# EasyEDA Pro project ProPrj_MiniFoc_AT32F435.epro, board 核心板
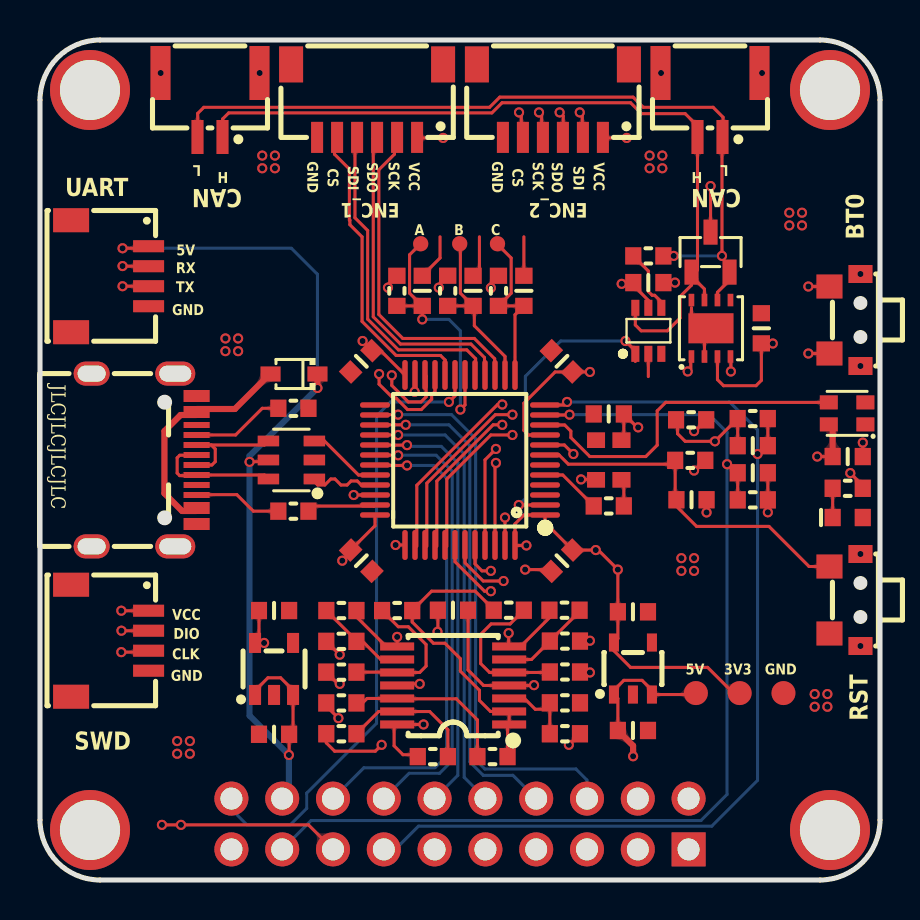
[diagram p5: board, top side]
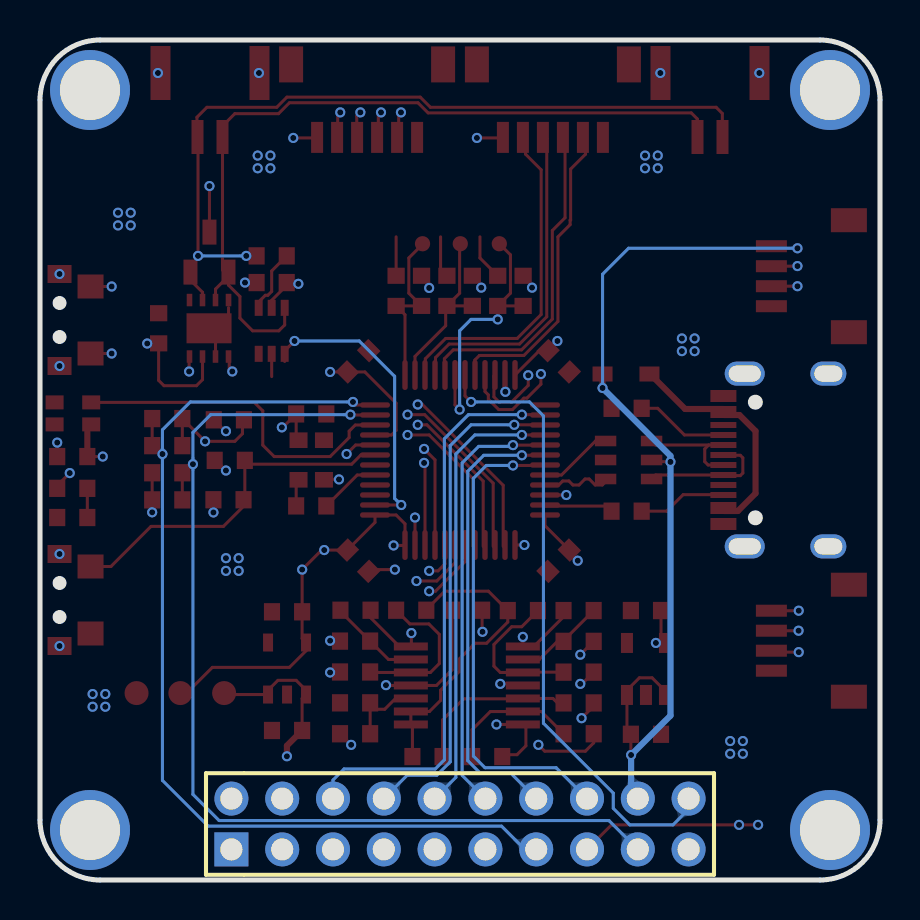
[diagram p6: board, bottom side, seen from below]

Outline 42 x 42 mm; copper layers: Top Layer, Inner1, Inner2, Bottom Layer. Coordinates in mm from the lower left corner of the outline.
Outline path: 0,39 0,3 arc(0.88,0.88) 3,0 39,0 arc(41.12,0.88) 42,3 42,39 arc(41.12,41.12) 39,42 3,42 arc(0.88,41.12) 0,39
Stack: Top Layer 0.035mm / Dielectric1 0.48mm PP er 4.5 / Inner1 0.035mm / Dielectric2 0.48mm FR4 er 4.5 / Inner2 0.035mm / Dielectric3 0.48mm PP er 4.5 / Bottom Layer 0.035mm

## Design rules (mm)
net USB_DP: USB
net USB_DM: USB
template: 用户自定义配置
spacing Default (default): track to track 0.127, other pairs 0 to 0.127
track width Default (default): min 0.152, default 0.152, max 25.4
differential pair differentialPair (default): width min 0.127, default 0.254, max 2.54; gap min 0.152, default 0.152
via Default (default): diameter min 0.508, default 0.508, max 100.025; hole min 0.305, default 0.305, max 59.995
net VCC uses 直连
net GND uses 直连
net 5V uses 直连

## Placement (name value [footprint] x y rotation side)
C1  100nF  [C0603_SMALL]  16.07 25.93 45 top
C7  2.2uF  [C0603_SMALL]  35.64 20.36 180 top
C10  100nF  [C0603_SMALL]  40.39 21.17 0 top
C13  100nF  [C0603_SMALL]  32.58 19.01 180 top
C14  100nF  [C0603_SMALL]  26.1 15.97 45 top
C17  100nF  [C0603_SMALL]  16.07 15.97 135 top
C18  100nF  [C0603_SMALL]  36.07 27.59 270 top
C19  100nF  [C0603_SMALL]  28.44 23.3 0 top
C30  1uF  [C0603_SMALL]  11.7 13.47 180 top
C31  1uF  [C0603_SMALL]  11.7 7.29 0 top
C32  100nF  [C0603_SMALL]  26.1 25.93 135 top
C46  2.2uF  [C0603_SMALL]  35.64 21.72 0 top
C89  10uF  [C0603_SMALL]  29.65 7.48 180 top
C90  10uF  [C0603_SMALL]  29.65 13.41 180 top
C91  1nF  [C0603_SMALL]  24.19 29.46 270 top
C92  1nF  [C0603_SMALL]  21.65 29.46 270 top
C93  1nF  [C0603_SMALL]  19.11 29.46 270 top
C94  100nF  [C0603_SMALL]  20.65 13.49 0 top
C95  100nF  [C0603_SMALL]  30.42 29.87 0 top
CN1  M1010RS-04P  [CONN-SMD_M1010RS-04P]  3.49 30.19 270 top
CN4  M1010RS-04P  [CONN-SMD_M1010RS-04P]  3.49 11.96 270 top
CN5  M1010RS-06P  [CONN-SMD_M1010RS-06P]  16.35 38.96 0 top
CN7  X1251WRS-02HF-LPSW  [CONN-SMD_2P-P1.25_X1251WRS-02HF-LPSW]  33.5 38.75 180 top
CN8  X1251WRS-02HF-LPSW  [CONN-SMD_2P-P1.25_X1251WRS-02HF-LPSW]  8.5 38.75 180 top
CN9  M1010RS-06P  [CONN-SMD_M1010RS-06P]  25.65 38.96 0 top
D1  -  [SOT-23-6_L2.9-W1.6-P0.95-LS2.8-BL]  12.57 21 90 top
D8  1N5819WS  [SOD-323_L1.8-W1.3-LS2.5-RD]  12.7 25.3 180 top
D9  NUP2105LT1G  [SOT-23-3_L2.9-W1.3-P1.90-LS2.4-BR]  33.53 31.4 270 top
H2  2.54-2*10  [HDR-TH_20P-P2.54-V-M-R2-C10-S2.54]  21 2.8 180 bottom
LED2  NCD0603B1  [LED0603_RED_SMALL]  40.39 18.12 0 top
LED4  WS2812B-2020  [LED-SMD_4P-L2.0-W2.0-TL_WS2812B-2020]  40.35 23.33 180 top
NOREF  -  [Pad_e1832]  2.5 2.5 180 top
NOREF#2  -  [Pad_e1834]  39.5 39.5 180 top
NOREF#3  -  [Pad_e1566]  39.5 2.5 180 top
NOREF#4  -  [Pad_e1565]  2.5 39.5 180 top
R4  10kΩ  [R0603_SMALL]  32.51 20.98 180 top
R6  1kΩ  [R0603_SMALL]  40.39 19.58 180 top
R9  120Ω  [R0603_SMALL]  30.42 31.2 180 top
R10  10kΩ  [R0603_SMALL]  32.56 23.01 180 top
R12  22Ω  [R0603_SMALL]  28.44 18.7 0 top
R13  3.3kΩ  [R0603_SMALL]  35.64 23.07 180 top
R15  3.3kΩ  [R0603_SMALL]  35.64 19.01 0 top
R20  1kΩ  [R0603_SMALL]  26.25 8.86 0 top
R21  1kΩ  [R0603_SMALL]  26.25 7.31 180 top
R67  100kΩ  [R0603_SMALL]  19.64 6.17 180 top
R71  100kΩ  [R0603_SMALL]  15.07 13.47 0 top
R75  100kΩ  [R0603_SMALL]  26.23 13.49 180 top
R76  100kΩ  [R0603_SMALL]  23.44 13.49 0 top
R77  100kΩ  [R0603_SMALL]  17.86 13.47 180 top
R78  100kΩ  [R0603_SMALL]  22.63 6.17 180 top
R79  2kΩ  [R0603_SMALL]  15.07 7.31 180 top
R80  2kΩ  [R0603_SMALL]  15.07 8.85 180 top
R81  2kΩ  [R0603_SMALL]  15.07 11.93 180 top
R82  2kΩ  [R0603_SMALL]  15.07 10.39 180 top
R83  2kΩ  [R0603_SMALL]  26.25 11.94 0 top
R84  2kΩ  [R0603_SMALL]  26.25 10.4 0 top
R85  22Ω  [R0603_SMALL]  22.92 29.46 90 top
R86  22Ω  [R0603_SMALL]  20.38 29.46 90 top
R87  22Ω  [R0603_SMALL]  17.84 29.46 90 top
R88  5.1kΩ  [R0603_SMALL]  12.67 18.44 0 top
R89  5.1kΩ  [R0603_SMALL]  12.67 23.58 0 top
SW3  TS24CA  [SW-SMD_TS24CA]  40.25 28 270 top
SW4  TS24CA  [SW-SMD_TS24CA]  40.25 14 270 top
TP1  Testpoint 1.6mm  [TESTPOINT 1.6MM]  34.98 9.35 0 top
TP2  Testpoint 1.6mm  [TESTPOINT 1.6MM]  32.79 9.35 0 top
TP3  Testpoint 1.6mm  [testpoint 1.6mm]  22.87 31.81 0 top
TP4  Testpoint 1.6mm  [testpoint 1.6mm]  19.03 31.81 0 top
TP6  Testpoint 1.6mm  [testpoint 1.6mm]  20.99 31.81 0 top
TP7  Testpoint 1.6mm  [TESTPOINT 1.6MM]  37.17 9.35 0 top
U3  AT32F435CGT7  [LQFP-48_L7.0-W7.0-P0.50-LS9.0-BL]  21 21 90 top
U6  SIT3051TK  [DFN-8_L3.0-W3.0-P0.65-BL-EP]  33.55 27.59 0 top
U7  XC6210B332MR  [SOT-25_L3.0-W1.6-P0.95-LS2.8-BL]  29.65 10.57 0 top
U13  LP5907MFX-3.3/NOPB  [SOT-23-5_L3.0-W1.7-P0.95-LS2.8-BR]  11.7 10.55 270 top
U16  RS724XQ  [TSSOP-14_L5.0-W4.4-P0.65-LS6.4-BL]  20.66 9.73 90 top
U17  GS4157B-CR  [SC70-6_L2.1-W1.3-P0.65-LS2.3-BL]  30.42 27.46 0 top
USBC1  TYPE-C-31-M-12  [USB-C_SMD-TYPE-C-31-M-12]  5.21 21 270 top
X1  8MHz  [OSC-SMD_4P-L2.5-W2.0-BL_DSB321SDA]  28.44 21 270 top

## Footprints (pads in the part's own frame, mm; a bottom-side part is the same pattern mirrored in y, then rotated)
C0603_SMALL
  rect 0.806x0.864 smd: 1(-0.753,0) 2(0.753,0)
CONN-SMD_2P-P1.25_X1251WRS-02HF-LPSW
  rect 0.6x1.7 smd: 1(-0.625,1.6) 2(0.625,1.6)
  rect 1x2.7 smd: 3(2.475,-1.6) 4(-2.475,-1.6)
CONN-SMD_M1010RS-04P
  rect 0.6x1.55 smd: 1(-1.5,1.938) 2(-0.5,1.938) 3(0.5,1.938) 4(1.5,1.938)
  rect 1.2x1.8 smd: 5(2.8,-1.938) 6(-2.8,-1.938)
CONN-SMD_M1010RS-06P
  rect 1.2x1.8 smd: 0(-3.8,1.825) 0(3.8,1.825)
  rect 0.6x1.55 smd: 1(2.5,-1.825) 2(1.5,-1.825) 3(0.5,-1.825) 4(-0.5,-1.825) 5(-1.5,-1.825) 6(-2.5,-1.825)
DFN-8_L3.0-W3.0-P0.65-BL-EP
  rect 0.28x0.625 smd: 1(-0.976,-1.412) 2(-0.325,-1.412) 3(0.325,-1.412) 4(0.976,-1.412) 5(0.976,1.412) 6(0.325,1.412) 7(-0.325,1.412) 8(-0.976,1.412)
  rect 2.251x1.501 smd: 9(0,0)
HDR-TH_20P-P2.54-V-M-R2-C10-S2.54
  rect 1.7x1.7 hole 1.1: 1(-11.43,-1.27)
  round 1.7 hole 1.1: 2(-11.43,1.27) 3(-8.89,-1.27) 4(-8.89,1.27) 5(-6.35,-1.27) 6(-6.35,1.27) 7(-3.81,-1.27) 8(-3.81,1.27) 9(-1.27,-1.27) 10(-1.27,1.27) 11(1.27,-1.27) 12(1.27,1.27) 13(3.81,-1.27) 14(3.81,1.27) 15(6.35,-1.27) 16(6.35,1.27) 17(8.89,-1.27) 18(8.89,1.27) 19(11.43,-1.27) 20(11.43,1.27)
LED0603_RED_SMALL
  rect 0.806x0.864 smd: 1(0.753,0) 2(-0.753,0)
LED-SMD_4P-L2.0-W2.0-TL_WS2812B-2020
  rect 0.9x0.7 smd: 1(-0.915,0.55) 2(-0.915,-0.55) 3(0.915,-0.55) 4(0.915,0.55)
LQFP-48_L7.0-W7.0-P0.50-LS9.0-BL
  oval 0.27x1.5 smd: 1(-2.75,-4.25) 2(-2.25,-4.25) 3(-1.75,-4.25) 4(-1.25,-4.25) 5(-0.75,-4.25) 6(-0.25,-4.25) 7(0.25,-4.25) 8(0.75,-4.25) 9(1.25,-4.25) 10(1.75,-4.25) 11(2.25,-4.25) 12(2.75,-4.25) 25(2.75,4.25) 26(2.25,4.25) 27(1.75,4.25) 28(1.25,4.25) 29(0.75,4.25) 30(0.25,4.25) 31(-0.25,4.25) 32(-0.75,4.25) 33(-1.25,4.25) 34(-1.75,4.25) 35(-2.25,4.25) 36(-2.75,4.25)
  oval 1.5x0.27 smd: 13(4.25,-2.75) 14(4.25,-2.25) 15(4.25,-1.75) 16(4.25,-1.25) 17(4.25,-0.75) 18(4.25,-0.25) 19(4.25,0.25) 20(4.25,0.75) 21(4.25,1.25) 22(4.25,1.75) 23(4.25,2.25) 24(4.25,2.75) 37(-4.25,2.75) 38(-4.25,2.25) 39(-4.25,1.75) 40(-4.25,1.25) 41(-4.25,0.75) 42(-4.25,0.25) 43(-4.25,-0.25) 44(-4.25,-0.75) 45(-4.25,-1.25) 46(-4.25,-1.75) 47(-4.25,-2.25) 48(-4.25,-2.75)
OSC-SMD_4P-L2.5-W2.0-BL_DSB321SDA
  rect 0.78x0.9 smd: 1(-0.99,-0.635) 2(0.99,-0.635) 3(0.99,0.635) 4(-0.99,0.635)
Pad_e1565
  round 4 hole 3: 1(0,0)
Pad_e1566
  round 4 hole 3.005x3: 1(0,0)
Pad_e1832
  round 4 hole 3.005x3: 1(0,0)
Pad_e1834
  round 4 hole 3.005x3: 1(0,0)
R0603_SMALL
  rect 0.806x0.864 smd: 1(-0.753,0) 2(0.753,0)
SC70-6_L2.1-W1.3-P0.65-LS2.3-BL
  rect 0.4x0.8 smd: 1(-0.65,-1.15) 2(-0.001,-1.15) 3(0.65,-1.15) 4(0.65,1.15) 5(0,1.15) 6(-0.65,1.15)
SOD-323_L1.8-W1.3-LS2.5-RD
  rect 1x0.75 smd: 1(-1.173,0) 2(1.173,0)
SOT-23-3_L2.9-W1.3-P1.90-LS2.4-BR
  rect 1.25x0.7 smd: 1(1,-0.95) 2(1,0.95) 3(-1,0)
SOT-23-5_L3.0-W1.7-P0.95-LS2.8-BR
  rect 1x0.6 smd: 1(1.3,-0.95) 2(1.3,0) 3(1.3,0.95) 4(-1.3,0.95) 5(-1.3,-0.95)
SOT-23-6_L2.9-W1.6-P0.95-LS2.8-BL
  rect 0.532x1.072 smd: 1(-0.95,-1.149) 2(0,-1.149) 3(0.95,-1.149) 4(0.95,1.149) 5(0,1.149) 6(-0.95,1.149)
SOT-25_L3.0-W1.6-P0.95-LS2.8-BL
  rect 0.5x0.899 smd: 1(-0.95,-1.3) 2(0,-1.3) 3(0.95,-1.3) 4(0.95,1.3) 5(-0.95,1.3)
SW-SMD_TS24CA
  rect 0.9x1.2 smd: 1(-2.3,0.775) 2(2.3,0.775)
  rect 1.2x1.3 smd: 3(-1.675,-0.775) 4(1.675,-0.775)
testpoint 1.6mm
  round 0.762 smd: 1(0,0)
TESTPOINT 1.6MM
  round 1.2 smd: 1(0,0)
TSSOP-14_L5.0-W4.4-P0.65-LS6.4-BL
  rect 0.4x1.7 smd: 1(-1.95,-2.8) 2(-1.3,-2.8) 3(-0.65,-2.8) 4(0,-2.8) 5(0.65,-2.8) 6(1.3,-2.8) 7(1.95,-2.8) 8(1.95,2.8) 9(1.3,2.8) 10(0.65,2.8) 11(0,2.8) 12(-0.65,2.8) 13(-1.3,2.8) 14(-1.95,2.8)
USB-C_SMD-TYPE-C-31-M-12
  oval 1.2x1.8 hole 0.8x1.4: 0(-4.32,-2.624) 1(4.32,-2.624)
  oval 1.2x2 hole 0.8x1.6: 2(4.32,1.556) 3(-4.32,1.556)
  rect 0.3x1.3 smd: A1(-3.35,2.623) A4(-2.55,2.623) A5(-1.25,2.623) A6(-0.25,2.623) A7(0.25,2.623) A8(1.25,2.624) A9(2.55,2.623) A12(3.35,2.623) B1(3.05,2.623) B4(2.25,2.623) B5(1.75,2.623) B6(0.75,2.623) B7(-0.75,2.623) B8(-1.75,2.624) B9(-2.25,2.623) B12(-3.05,2.623)

## Nets
As in the schematic.

Pads without a net: CN5 0; CN9 0; LED4 1; NOREF 1; NOREF#2 1; NOREF#3 1; NOREF#4 1; U3 3 4 6 25; U6 5; U7 4; U13 4; U17 3; USBC1 1 2 3 A8 B8; X1 1

## Via types
v1: diameter 0.508, hole 0.305, Top Layer to Bottom Layer, 129 vias

## Routing (per net, layer and track width the routed paths; a pad name or vN(x,y) marks a point on that pad's centre or on a via; arc(x,y) is an arc through that point)
5V: length 97.6
  Top Layer w0.152: 10.48,20.92 11.34,20.92 D1.5 ; TP2.1 32.72,9.27 U7.3 30.6,9.49 30.1,9.98 29.19,9.98 28.7,9.49 U7.1 28.89,9.08 C89.2 ; C10.1 v1(38.86,21.17) ; v1(4.13,31.59) 5.39,31.59 5.49,31.69 ; U13.1 10.75,9.47 11.4,10.11 12.03,10.11 12.65,9.49 U13.3 12.65,7.48 C31.2 12.46,6.19
  Top Layer w0.305: C89.2 29.65,6.72 v1(29.65,6.19) ; C10.1 39.63,22.59 LED4.4 ; D8.1 v1(13.87,24.6)
  Inner1 w0.152: H2.18 13.6,4.07 ; v1(38.86,21.17) 38.86,15.39 v1(29.65,6.19)
  Inner1 w0.305: v1(29.65,6.19) 14.23,6.19 H2.18
  Bottom Layer w0.152: v1(4.13,31.59) 12.57,31.59 13.87,30.29 v1(13.87,24.6)
  Bottom Layer w0.305: H2.18 12.45,4.41 v1(12.45,6.25) 10.48,8.22 v1(10.48,20.91) 10.48,21.21 v1(13.87,24.6)
AVCC: length 51.1
  Top Layer w0.152: C94.2 21.4,10.5 22.18,9.73 U16.4 24.69,9.73 v1(24.7,9.74) ; v1(27.5,25.4) 25.76,25.4 24.19,23.84 24.19,22.48 24.42,22.25 U3.9 ; 27,7.31 v1(26.44,6.76) 26.35,6.76 ; v1(11.21,11.85) U13.5 10.95,12.05 10.95,13.22
  Inner1 w0.152: v1(11.21,11.85) 12.33,12.98 24.86,12.98
  Inner1 w0.305: v1(27.5,25.4) 26.52,25.4 24.89,23.78 24.89,13.01 24.7,12.82 v1(24.7,9.74) 26.44,8 v1(26.44,6.76)
GND: length 33.7
  Top Layer w0.152: v1(18.73,24.41) 18.73,25.23 U3.23 ; 21.97,32.16 21.97,30.53 C92.1 ; v1(24.26,15.52) 25.48,15.52 C14.1 ; 20,32.16 20,31.1 C93.1 ; U3.8 26.22,21.75 v1(26.67,21.3) ; U3.35 16.7,18.7 13.68,18.7 R88.2 ; C10.2 v1(41.14,21.87) ; 36.39,18.38 v1(36.39,18.38) R15.2 C7.1 ; C91.1 24.19,32.16 ; v1(18.99,9.81) 17.94,9.81 U16.11 ; v1(19.88,12.41) 19.89,12.43 C94.1 ; 34.88,21.72 R13.2 v1(33.75,21.93) 32.26,21.93 31.88,22.31 31.88,22.94 R10.2 ; 33.22,26.11 33.22,26.88 33.55,27.2 33.27,27.2 32.58,27.9 32.58,28.28 32.57,28.29 32.57,28.62 ; D9.3 v1(33.53,34.7) ; U17.2 30.42,25.17 ; C13.1 v1(33.33,18.38) ; v1(27.05,20.03) 27.78,20.03 X1.2 ; U3.47 v1(23.25,18.12)
  vias: v1(6.03,40.35) v1(6.86,6.95) v1(6.86,6.31) v1(7.49,6.95) v1(7.49,6.31) v1(9.27,27.08) v1(9.27,26.44) v1(9.91,27.08) v1(9.91,26.44) v1(10.98,40.35) v1(11.11,36.22) v1(11.11,35.59) v1(11.75,36.22) v1(11.75,35.59) v1(30.48,36.22) v1(30.48,35.59) v1(31.05,40.35) v1(31.12,36.22) v1(31.12,35.59) v1(31.75,29.87) v1(32.07,16.09) v1(32.07,15.46) v1(32.7,16.09) v1(32.7,15.46) v1(36.1,40.35) v1(37.47,33.36) v1(37.47,32.73) v1(38.1,33.36) v1(38.1,32.73) v1(38.74,9.3) v1(38.74,8.66) v1(39.37,9.3) v1(39.37,8.66) v1(41.02,30.3) v1(41.02,25.7) v1(41.02,16.3) v1(41.02,11.7)
VCC: length 51.1
  Top Layer w0.152: U6.3 33.87,25.02 34.18,24.72 35.8,24.72 36.07,24.98 36.07,26.82 v1(36.64,26.82) ; 41.14,19.58 41.14,19.72 v1(40.51,20.35) ; 34.67,9.35 33.38,10.63 29.53,10.63 28.7,11.46 U7.5 28.89,12.07 C90.2 ; v1(15.11,15.97) 15.53,16.39 C17.2 16.75,17.72 U3.36 ; v1(16.13,26.95) 16.13,26.94 C1.2 17.03,26.47 U3.24 ; 18.72,37.1 20.13,37.1 ; C95.1 29.66,29.74 30.42,28.98 U17.5 ; v1(24.32,16.73) 23.77,16.73 U3.48 23.75,17.81 24.19,18.25 U3.1 25.25,17.88 C14.2 v1(27.79,16.5) 27.92,16.5 v1(28.89,15.52) 28.89,13.41 ; CN4.1 v1(4.06,13.46) ; v1(6.1,2.76) v1(7.05,2.76) 13.42,2.76 H2.15 ; SW3.3 v1(38.42,29.67) ; R4.1 33.21,20.98 v1(32.7,20.47) ; X1.4 29.19,22.11 C19.2 29.86,22.63 v1(29.91,22.63) ; 27.96,37.1 v1(29.34,37.1)
  vias: v1(20.16,37.1) v1(29.08,29.81)
AUX_H: length 20.7
  Top Layer w0.152: v1(22.54,14.44) 22.22,14.44 20.75,15.92 U3.42
  Inner2 w0.152: H2.4 30.16,4.34 30.16,13.3 29.02,14.44 v1(22.54,14.44)
AUX_L: length 22
  Top Layer w0.152: U3.43 21.25,15.86 22.16,14.95 v1(23.18,14.95)
  Inner2 w0.152: v1(23.18,14.95) 30.16,14.95 32.45,12.66 32.45,4.09 H2.2
BOOT0: length 26.2
  Top Layer w0.152: R10.1 32.74,22.44 v1(32.7,22.44) ; v1(22.54,15.46) 22.1,15.46 21.75,15.81 U3.44 ; SW3.4 v1(38.42,26.33)
  Inner2 w0.152: v1(38.42,26.33) 34.53,22.44 v1(32.7,22.44) 30.8,20.54 24.19,20.54 22.54,18.89 v1(22.54,15.46)
CAN_120: length 14.8
  Top Layer w0.152: 29.77,25.93 29.77,26.46 v1(29.27,26.95) ; U3.2 v1(23.94,18.75)
  Bottom Layer w0.152: v1(23.94,18.75) 24.27,19.08 24.27,25.19 26.03,26.95 v1(29.27,26.95)
CAN_H: length 39.1
  Top Layer w0.152: U6.7 33.22,29.55 32.58,30.19 32.58,29.75 32,29.17 32,28.09 31.37,27.46 30.06,27.46 29.77,27.75 29.77,28.23 ; 9.13,37.15 9.13,38.05 9.44,38.36 22.59,38.36 23.1,38.86 29.53,38.86 30.07,38.32 32.26,38.32 32.9,37.67 ; 32.88,30.49 CN7.2
CAN_L: length 39.2
  Top Layer w0.152: 7.88,37.15 7.88,38.33 8.19,38.63 22.48,38.63 22.99,39.14 29.65,39.14 30.16,38.63 33.66,38.63 34.15,38.14 34.15,37.18 CN7.1 ; v1(34.1,31.2) 34.1,37.15 ; U6.6 33.87,29.39 34.48,29.99 D9.2
  Bottom Layer w0.152: v1(34.1,31.2) v1(31.69,31.2)
CAN_RX: length 19.6
  Top Layer w0.152: v1(34.54,25.43) 34.54,26.15 U6.4 ; U3.45 22.25,21.01 v1(22.8,21.55)
  Inner2 w0.152: v1(22.8,21.55) 25.53,21.55 29.91,25.93 34.04,25.93 v1(34.54,25.43)
CAN_TX: length 16.4
  Top Layer w0.152: U3.46 22.75,20.81 v1(22.8,20.85) ; U6.1 32.54,26.14 32.54,25.58 v1(32.38,25.43)
  Inner2 w0.152: v1(22.8,20.85) 25.4,20.85 29.97,25.43 v1(32.38,25.43)
CUR_A: length 13.5
  Top Layer w0.152: U3.18 21.25,23.75 v1(21.02,23.52) ; 19.11,28.71 18.48,29.34 18.48,31.26 19.03,31.81 ; C93.2 v1(19.11,28.03) ; R87.1 19.11,28.7
  Bottom Layer w0.152: v1(21.02,23.52) 21.02,27.46 20.45,28.03 v1(19.11,28.03)
CUR_B: length 8.8
  Top Layer w0.152: U3.14 23.25,26.18 21.72,27.71 21.72,28.64 21.65,28.71 ; R86.1 21.65,28.71 21.02,29.34 21.02,31.81 20.99,31.84
CUR_C: length 8.5
  Top Layer w0.152: 22.87,31.79 23.56,31.1 23.56,29.34 R85.1 24.19,28.7 23.75,28.26 U3.13
M0_SN_A: length 10.6
  Top Layer w0.152: R84.2 27.47,10.4 v1(27.5,10.38)
  Inner2 w0.152: H2.3 29.89,1.76 28.4,3.25 28.4,9.98 28,10.38 v1(27.5,10.38)
M0_SN_B: length 15.1
  Top Layer w0.152: R82.2 14.9,9.81 v1(14.99,9.81)
  Inner2 w0.152: H2.7 23.43,2.91 23.43,4.53 22.54,5.42 19.75,5.42 16.01,9.17 15.62,9.18 v1(14.99,9.81)
M0_SN_C: length 9.3
  Top Layer w0.152: 14.31,8.55 14.47,8.55 v1(14.92,8.09)
  Inner2 w0.152: v1(14.92,8.09) 18.35,4.66 18.35,3.14 19.73,1.76 H2.11
M0_SP_A: length 14.3
  Top Layer w0.152: v1(27.5,11.96) 27.48,11.94 R83.2
  Inner2 w0.152: H2.1 31.14,2.82 29.46,2.82 28.77,3.52 28.77,11.27 28.07,11.96 v1(27.5,11.96)
M0_SP_B: length 18.9
  Top Layer w0.152: 14.31,12.24 14.31,11.94 v1(14.99,11.27)
  Inner2 w0.152: H2.5 26.12,2.76 24.26,2.76 23.75,3.27 23.75,4.73 22.67,5.81 19.76,5.81 16.32,9.25 16.32,9.93 v1(14.99,11.27)
M0_SP_C: length 11.9
  Top Layer w0.152: 14.37,7.31 R79.2 14.31,6.86 14.73,6.44 16.76,6.44 v1(17.08,6.76)
  Inner2 w0.152: v1(17.08,6.76) 18.67,5.17 18.67,3.46 19.37,2.76 21.04,2.76 H2.9
NRST: length 18
  Top Layer w0.152: U3.7 25.96,21.25 26.42,20.79 31.57,20.79 R4.2 31.76,19.08 C13.2 31.82,18.69 32.83,17.68 36.45,17.68 38.45,15.67 SW4.3
PWMA_H: length 21.6
  Top Layer w0.152: v1(18.35,21.74) 16.91,21.74
  Bottom Layer w0.152: v1(18.35,21.74) 18.41,21.68 20.07,21.68 20.89,20.85 20.89,5.23 H2.12
PWMA_L: length 28.5
  Top Layer w0.152: 16.84,23.18 16.84,23.22 16.89,23.27 v1(17.91,23.27)
  Bottom Layer w0.152: H2.6 27.35,5 26.8,5.55 22.24,5.55 21.78,6.01 21.78,22.06 20.57,23.27 v1(17.91,23.27)
PWMB_H: length 22.7
  Top Layer w0.152: v1(17.91,21.24) 16.9,21.24
  Bottom Layer w0.152: H2.14 18.46,5.33 19.98,5.33 20.61,5.97 20.61,20.44 19.81,21.24 v1(17.91,21.24)
PWMB_L: length 25
  Top Layer w0.152: 16.84,22.76 v1(18.29,22.76)
  Bottom Layer w0.152: H2.8 23.65,5.23 22.16,5.23 21.49,5.91 21.49,21.72 20.45,22.76 v1(18.29,22.76)
PWMC_H: length 24.2
  Top Layer w0.152: v1(18.35,20.73) 16.89,20.73
  Bottom Layer w0.152: v1(18.35,20.73) 19.69,20.73 20.33,20.08 20.33,6.2 19.75,5.61 16.19,5.61 H2.16
PWMC_L: length 22.4
  Top Layer w0.152: v1(17.91,22.25) 16.91,22.25
  Bottom Layer w0.152: H2.10 21.21,5.13 21.21,21.3 20.26,22.25 v1(17.91,22.25)
REF: length 15.1
  Top Layer w0.152: R76.1 22.68,13.52 21.76,14.44 19.58,14.44 R77.1 18.61,12.9 19.67,11.84 20.25,11.84 21.02,11.06 21.02,10.44 21.97,9.49 21.97,8.98 22.53,8.43 U16.2 U16.1 23.38,7.7 R78.1
RGB: length 17.2
  Top Layer w0.152: LED4.3 31.28,23.88 30.86,23.46 30.86,21.74 30.29,21.17 27.49,21.17 26.54,22.12 26.54,22.44 26.24,22.75 U3.10
SPI1_CS: length 15.5
  Top Layer w0.152: 20.26,25.26 20.26,26 20.03,26.23 17.81,26.23 16.1,27.93 16.1,32.16 15.49,32.77 15.49,32.99 15.47,32.99 15.47,35.55 14.72,36.29 14.72,37.14
SPI1_MISO: length 16.2
  Top Layer w0.152: 22.22,25.29 22.22,26.12 21.55,26.8 18.02,26.8 16.66,28.16 16.66,37.08 16.72,37.14
SPI1_MOSI: length 16.4
  Top Layer w0.152: 21.78,25.24 21.78,26.06 21.34,26.51 17.92,26.51 16.38,28.04 16.38,32.47 15.75,33.11 15.75,37.12 15.72,37.14
SPI1_SCK: length 16.7
  Top Layer w0.152: 22.73,25.28 22.73,26.06 21.72,27.08 18.14,27.08 16.94,28.28 16.94,35.51 17.72,36.29 17.72,37.14
SPI3_CS: length 25.4
  Top Layer w0.152: v1(23.95,38.38) 24.07,38.27 24.07,37.02 ; 18.84,16.68 18.84,19.73 22.88,23.78 v1(23.11,23.78)
  Inner2 w0.152: v1(23.11,23.78) 23.94,24.6 23.94,38.38
SPI3_MISO: length 26.4
  Top Layer w0.152: v1(25.98,38.38) 26.16,38.2 26.16,36.96 ; v1(23.11,22.76) 22.66,22.76 19.84,19.94 19.84,16.68
  Inner2 w0.152: 25.97,38.38 25.97,24.86 23.88,22.76 v1(23.11,22.76)
SPI3_MOSI: length 26.7
  Top Layer w0.152: v1(26.99,38.38) 27.11,38.25 27.11,37.02 ; v1(23.62,22.25) 22.54,22.25 20.34,20.05 20.34,16.68
  Inner2 w0.152: v1(23.62,22.25) 24,22.25 26.35,24.6 26.35,37.75 v1(26.99,38.38)
SPI3_SCK: length 26
  Top Layer w0.152: 19.34,16.68 19.34,19.84 22.77,23.27 v1(23.62,23.27) ; v1(24.95,38.38) 25.08,38.25 25.08,37.01
  Inner2 w0.152: v1(23.62,23.27) 24.96,24.6 24.96,38.38
SWCLK: length 17.8
  Top Layer w0.152: U3.37 v1(17.78,16.75) ; v1(4.06,11.39) 5.36,11.39 CN4.3
  Inner2 w0.152: v1(17.78,16.75) 17.76,16.73 11.75,16.73 6.41,11.39 v1(4.06,11.39)
SWDIO: length 16.9
  Top Layer w0.152: 4.06,12.47 v1(4.07,12.46) CN4.2 ; U3.34 v1(15.68,19.25)
  Inner2 w0.152: v1(15.68,19.25) 12.81,19.25 6.02,12.46 v1(4.07,12.46)
TEMP_1: length 53.1
  Top Layer w0.152: U3.11 26.46,23.25 v1(26.48,23.27) ; 34.29,20.92 34.29,20.85 v1(34.35,20.79) 34.89,20.26 R15.1
  Bottom Layer w0.152: v1(26.48,23.27) 33.46,23.27 34.35,22.38 v1(34.35,20.79) 34.35,4.28 33.05,2.97 13.55,2.97 H2.17
TEMP_2: length 51
  Top Layer w0.152: U3.12 26.2,23.75 v1(26.35,23.9) ; 36.39,23.07 C46.2 35.97,21.3 v1(35.88,21.3)
  Bottom Layer w0.152: v1(26.35,23.9) 34.48,23.9 35.88,22.51 v1(35.88,21.3) 35.88,4.98 33.59,2.69 18.92,2.69 17.76,1.53 H2.13
USART_RX: length 22.5
  Top Layer w0.152: v1(17.59,25.24) 17.59,24.73 18.41,23.9 19.05,23.9 19.3,24.16 19.3,25.2 U3.22 ; 5.49,30.69 4.14,30.69 v1(4.13,30.7)
  Inner2 w0.152: v1(4.13,30.7) 14.86,30.7 17.59,27.97 v1(17.59,25.24)
USART_TX: length 22.5
  Top Layer w0.152: U3.21 19.75,24.42 19.58,24.26 19.58,24.04 19.06,23.52 18.38,23.52 17.81,24.09 17.65,24.09 16.95,24.79 v1(16.95,25.3) ; 5.49,29.69 v1(4.13,29.69)
  Inner2 w0.152: v1(16.95,25.3) 16.95,27.59 14.85,29.69 v1(4.13,29.69)
USB_DM: length 3.7
  Top Layer w0.152: U3.32 15.92,20.25 14.22,21.95 D1.3
USB_DM_IN: length 5.6
  Top Layer w0.152: D1.4 11.22,21.75 8.57,21.75 ; USBC1.A7 8.59,20.75 8.76,20.92 8.76,21.55 8.57,21.75 ; 8.57,21.75 USBC1.B7
USB_DP: length 3.6
  Top Layer w0.152: U3.33 16.06,19.75 15.86,19.95 15.56,19.95 15.36,19.75 15.05,19.75 14.75,20.05 14.54,20.05 14.24,19.75 13.89,19.75 13.73,19.9 13.73,20.04 D1.1
USB_DP_IN: length 6.2
  Top Layer w0.152: 8.15,20.25 11.22,20.25 D1.6 ; USBC1.B6 7.8,20.22 6.99,20.22 6.86,20.35 6.86,21.11 6.99,21.24 7.82,21.24 USBC1.A6
V_BUS: length 31.4
  Top Layer w0.152: U3.19 20.75,24.21 v1(20.45,23.9)
  Bottom Layer w0.152: v1(20.45,23.9) 17.53,23.9 16.83,23.2 16.83,7.84 13.34,4.34 13.34,3.58 12.51,2.76 10.35,2.76 9.57,3.54 H2.20
VUSB: length 11.4
  Top Layer w0.305: USBC1.A4 9.74,23.55 11.49,25.3 D8.2 ; USBC1.B9 7.03,23.25 6.22,22.44 6.22,19.33 7.1,18.45 USBC1.A9
$3N234: length 1.5
  Top Layer w0.152: LED2.2 R6.2
$3N656: length 3.1
  Top Layer w0.152: U3.5 26.14,20.25 R12.1
$3N953: length 1.4
  Top Layer w0.152: R12.2 29.19,19.89 X1.3
$3N32197: length 3.5
  Top Layer w0.152: 25.49,8.57 25.49,8.54 ; 25.49,8.54 R21.2 ; 25.49,8.54 24.76,8.54 24.22,9.08 U16.3
$3N32209: length 4.7
  Top Layer w0.152: R71.1 15.55,12.24 15.82,12.24 ; 15.82,12.24 17.04,11.03 U16.9 ; 15.82,12.24 15.98,12.24
$3N32210: length 4.6
  Top Layer w0.152: R75.1 26.98,13.43 24.57,11.03 U16.6
$3N32219: length 6.8
  Top Layer w0.152: 17.86,8.42 19.48,8.42 20.39,7.51 R67.1 ; R79.1 16.93,8.43 U16.13
$3N32226: length 29.4
  Top Layer w0.152: v1(23.43,12.35) 23.43,11.78 23.46,11.76 U16.7 24.03,11.68 25.47,13.12 R75.2 ; v1(17.4,29.62) 17.4,29.77 R87.2
  Inner2 w0.152: v1(17.4,29.62) 17.4,29.94 17.78,30.32 22.67,30.32 23.11,29.87 23.11,29.43 22.03,28.35 22.03,14 23.43,12.6 v1(23.43,12.35)
$3N32227: length 22.5
  Top Layer w0.152: 20.38,30.21 19.94,29.77 v1(19.94,29.62) ; v1(17.86,12.16) U16.8 17.31,11.68 15.82,13.16 R71.2
  Inner2 w0.152: v1(19.94,29.62) 19.88,29.55 19.88,14.17 v1(17.86,12.16)
$3N32228: length 27.9
  Top Layer w0.152: v1(19.18,7.78) U16.14 17.71,7.62 17.71,6.71 18.15,6.27 18.79,6.27 R67.2 ; 22.42,29.62 22.42,29.7 R85.2
  Inner2 w0.152: v1(22.54,29.6) 21.53,28.59 21.53,10.13 v1(19.18,7.78)
$3N32230: length 7.8
  Top Layer w0.152: 25.49,10.4 25.47,10.38 U16.5 22.48,10.38 22.03,10.82 22.03,12.28 22.56,12.8 23.5,12.8 R76.2
$3N32232: length 7.6
  Top Layer w0.152: R77.2 17.91,12.66 18.41,12.66 19.3,11.77 19.3,10.69 18.99,10.38 U16.10 17.84,10.39 R82.1
$3N32233: length 8.5
  Top Layer w0.152: R78.2 21.87,8 20.82,9.06 17.87,9.06 U16.12 16.35,9.08 15.82,8.55
$3N32457: length 4.1
  Top Layer w0.152: 8.16,19.27 9.84,19.27 10.67,18.44 R88.1 ; 7.85,19.27 USBC1.B5
$3N32516: length 4.3
  Top Layer w0.152: R89.1 11.11,23.58 9.78,22.25 8.15,22.25
$3N63623: length 3.3
  Top Layer w0.152: R9.2 30.42,30.45 30.42,29.43 30.61,29.24 30.73,29.24 31.07,28.9 U17.4

## Copper pours and planes (outline as drawn; the poured copper is in the pictures)
GND on Top Layer: -2.22,43.65 44.77,43.65 44.77,-1.88 -2.22,-1.88
GND on Bottom Layer: -9.02,46.51 48.96,46.51 48.96,-5.88 -9.02,-5.88
GND on Inner1: -4.32,44.92 45.66,44.92 45.66,-3.21 -4.32,-3.21
VCC on Inner2: -6.22,45.56 47.05,45.56 47.05,-4.04 -6.22,-4.04

Small or netless copper shapes (teardrops, artwork), in the pictures only: 322 on Top Layer, 38 on Bottom Layer, 13 on Inner1, 46 on Inner2

## Text on the board
Top Silkscreen Layer: GND | RX | TX | 5V | H | A | B | C | 3V3 | L | VCC | CLK | DIO | CS | SDI | SDO | SCK | ENC_1 | ENC_2 | CAN | SWD | BT0 | UART | RST | JLCJLCJLCJLC
